# Altium project R1001-Trotta-PF.PrjPcb
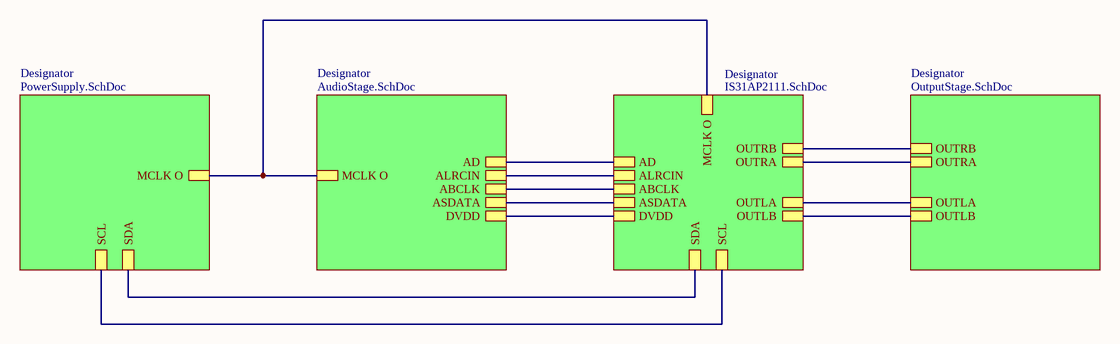
[diagram p0: TopLevel.SchDoc]
5 sheets, 118 parts. Net scope: hierarchical (ports join the sheet entries above them; power ports are global).
Board file: R1001-Trotta-PF-PCB.PcbDoc
Sheets:
  TopLevel.SchDoc
    Designator = PowerSupply.SchDoc
    Designator = AudioStage.SchDoc
    Designator = IS31AP2111.SchDoc
    Designator = OutputStage.SchDoc

## Sheet TopLevel.SchDoc: Top Level
size A4; Organization: Altium Limited; Address1: L3, 12a Rodborough Rd; Address2: Frenchs Forest; Address3: NSW; Address4: Australia 2086; Revision: 1.0; SheetNumber: 1; SheetTotal: 5; Alumno: Trotta, Ignacio; Curso: R1001; Materia: Sistemas de Representación; Docentes: JM Perdomo, E Ipar

### Sub-sheets
Designator = PowerSupply.SchDoc: MCLK O, SDA, SCL
Designator = AudioStage.SchDoc: ASDATA, AD, ALRCIN, ABCLK, MCLK O, DVDD
Designator = IS31AP2111.SchDoc: OUTRB, OUTRA, MCLK O, OUTLA, OUTLB, AD, ALRCIN, ASDATA, DVDD, SDA, SCL, ABCLK
Designator = OutputStage.SchDoc: OUTLB, OUTLA, OUTRB, OUTRA

### Nets
NetC21_1: sheet Designator/OUTLA, sheet Designator/OUTLA
NetC27_2: sheet Designator/OUTLB, sheet Designator/OUTLB
NetC32_1: sheet Designator/OUTRA, sheet Designator/OUTRA
NetC38_2: sheet Designator/OUTRB, sheet Designator/OUTRB
NetC41_1: sheet Designator/DVDD, sheet Designator/DVDD
NetP1_1: sheet Designator/SCL, sheet Designator/SCL
NetP1_2: sheet Designator/SDA, sheet Designator/SDA
NetP3_1: sheet Designator/MCLK O, sheet Designator/MCLK O, sheet Designator/MCLK O
NetP7_2: sheet Designator/AD, sheet Designator/AD
NetR8_1: sheet Designator/ASDATA, sheet Designator/ASDATA
NetR9_1: sheet Designator/ALRCIN, sheet Designator/ALRCIN
NetR10_1: sheet Designator/ABCLK, sheet Designator/ABCLK

### Notes on the sheet
- Title:
- Revision:
- Alumno:
- Materia:
- Docentes:
- Curso:
- File:
- Date:
- Sheet
- of

## Sheet PowerSupply.SchDoc: Power Supply
size A4; Organization: Altium Limited; Address1: L3, 12a Rodborough Rd; Address2: Frenchs Forest; Address3: NSW; Address4: Australia 2086; Revision: 1.0; SheetNumber: 2; SheetTotal: 5; Alumno: Trotta, Ignacio; Curso: R1001; Materia: Sistemas de Representación; Docentes: JM Perdomo, E Ipar
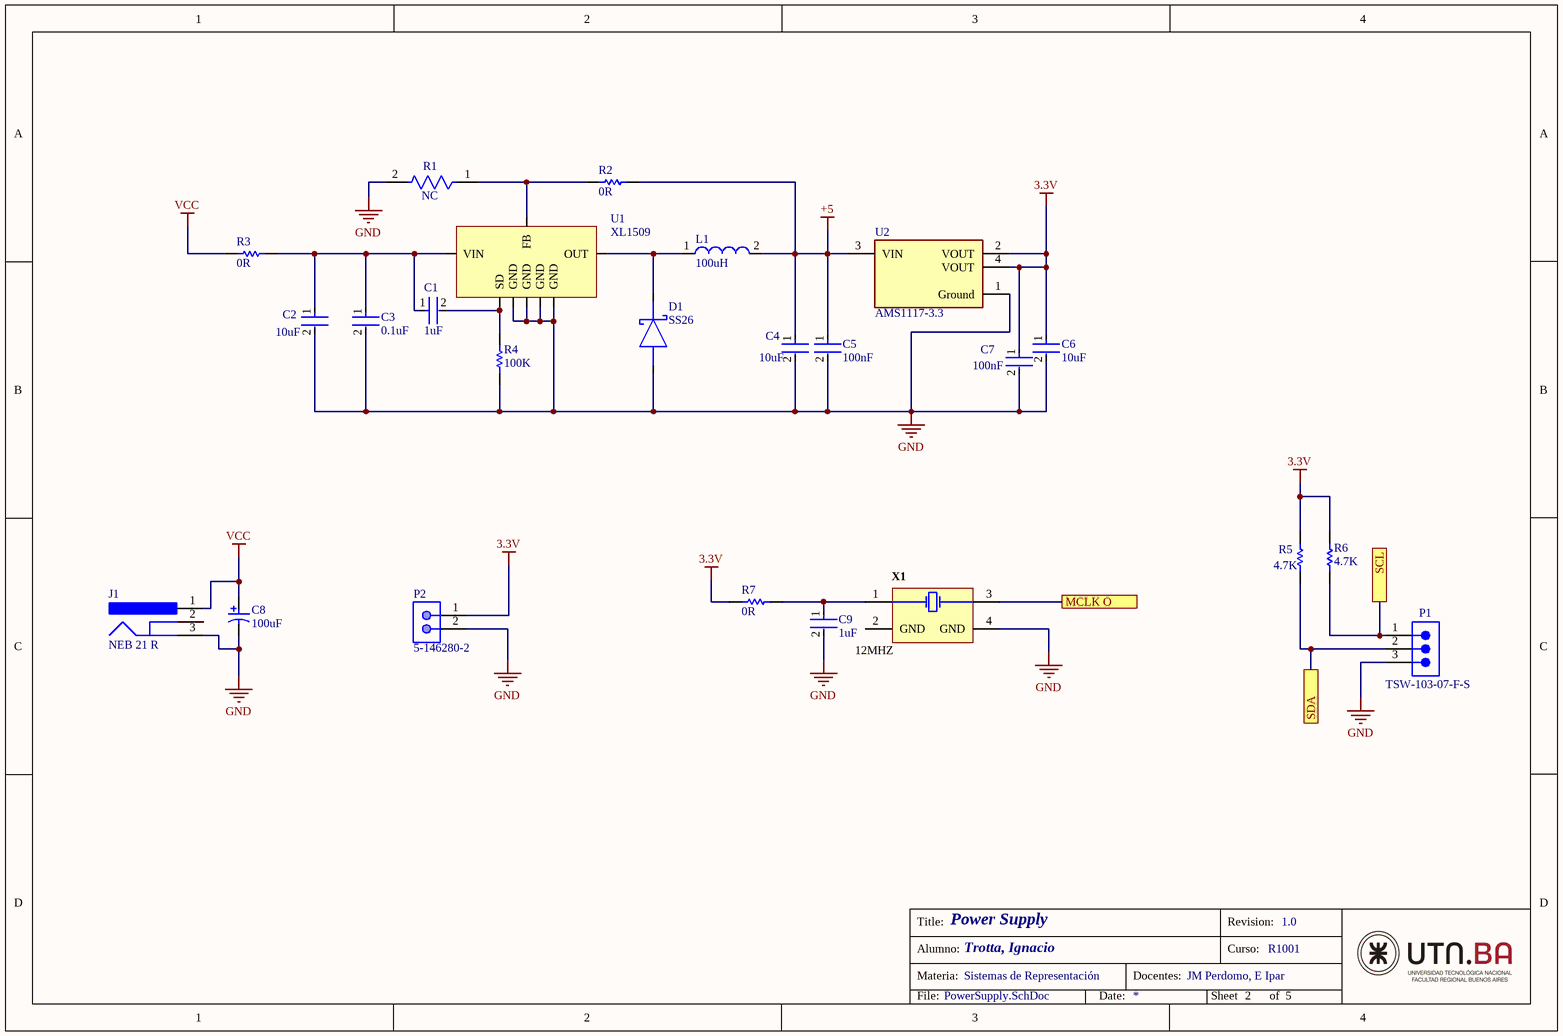
[diagram p1: PowerSupply.SchDoc]

### Parts
C1  1uF  [FP-CC0603-DA-MFG]
C2  10uF  [FP-CC1206-1_25-MFG]
C3  0.1uF  [FP-CC0603-DA-MFG]
C4  10uF  [FP-CC1206-1_25-MFG]
C5  100nF  [FP-CC0603-DA-MFG]
C6  10uF  [FP-CC0805-0_85-MFG]
C7  100nF  [FP-CC0603-DA-MFG]
C8  100uF  [NIC-UCL1V101MNL1GS_L]
C9  1uF  [FP-CC0603-DA-MFG]
D1  SS26  [SMB]
J1  NEB 21 R  [LUMB-NEB21R_V]
L1  100uH  [WE-PD2-M]
P1  TSW-103-07-F-S  [SMTC-TSW-103-07-X-S]
P2  5-146280-2  [TECO-5-146280-2_V]
R1  NC  [FP-RC2012-IPC_A]
R2  0R  [RESC1608X55X25ML10T15]
R3  0R  [RESC1608X55X25ML10T15]
R4  100K  [RESC1608X55X25ML10T15]
R5  4.7K  [RESC1608X55X25ML10T15]
R6  4.7K  [RESC1608X55X25ML10T15]
R7  0R  [RESC1608X55X25ML10T15]
U1  XL1509  [SOIC8]
U2  AMS1117-3.3  [FP-AMS1117-IPC_C]
X1  12MHZ  [ABRACON_ABM8G_V]

### Ports
MCLK O, SCL, SDA

### Nets
3.3V: C6.1 C7.1 P2.1 R5.2 R6.2 R7.1 U2.2(VOUT) U2.4(VOUT)
+5: C4.1 C5.1 L1.2 R2.2 U2.3(VIN)
GND: C2.2 C3.2 C4.2 C5.2 C6.2 C7.2 C8.2 C9.2 D1.A J1.3 P1.3 P2.2 R1.2 R4.1 U1.5(GND) U1.6(GND) U1.7(GND) U1.8(GND) U2.1(Ground) X1.4(GND)
VCC: C8.1 J1.1 R3.1
NetC1_1: C1.1 C2.1 C3.1 R3.2 U1.1(VIN)
NetC1_2: C1.2 R4.2 U1.4(SD)
NetC9_1: C9.1 R7.2 X1.1(X1)
NetD1_C: D1.C(K) L1.1 U1.2(OUT)
NetP1_1: P1.1 R6.1 ; port SCL
NetP1_2: P1.2 R5.1 ; port SDA
NetP3_1: X1.3(X2) ; port MCLK O
NetR1_1: R1.1 R2.1 U1.3(FB)

Not connected (* = marked no-connect by the designer): J1 2; X1 2(GND)

### Notes on the sheet
- Title:
- Revision:
- Alumno:
- Materia:
- Docentes:
- Curso:
- File:
- Date:
- Sheet
- of

### Library data of the parts
C1 C3 C5 C7 C9 = CMP-2100-03600-2: CAP CER 10000PF 50V X7R 0603; Manufacturer Part Number: CC0603KRX7R9BB103; Manufacturer: YAGEO; Tolerance: 0.1; Material: Ceramic; Temperature Coefficient: 15%; Value: 10 nF; Mouser Description: Multilayer Ceramic Capacitor, CC Series, 0.01 - F, - 10%, X7R, 50 V, 0603 [1608 Metric]; Digikey Description: CAP CER 10000PF 50V X7R 0603; Height: 0.9mm; Category: Cap; Temperature Characteristic: X7R; Footprint Url: http://www.yageo.com/exep/pages/download/literatures/UPY-C_GEN_24.pdf; Lead Free: Yes; Voltage Rating: 50 V; Temperature: -55°C to +125°C; Device Class L3: Ceramic Capacitors; ComponentLink2Description: Datasheet; Voltage: 50 V; Package: CC0603-DA; Octopart: https://octopart.com/cc0603krx7r9bb103-yageo-192938; Automotive: No; Temperature Range High: +125°C; Temperature Range Low: -55°C; RoHS: TRUE; Device Class L1: Passive Components; ComponentLink2URL: http://www.yageo.com/documents/recent/UPY-GPHC_X7R_6.3V-to-50V_18.pdf; Device Class L2: Capacitors; Capacitance: 10 nF
C2 C4 = CMP-03422-000842-1: CAP CER 0.1UF 50V X7R 1206; Manufacturer: Yageo; Manufacturer Part Number: CC1206KRX7R9BB104; Automotive Grade: NA; Value: 100 nF; Tolerance: 0.1; Material: Ceramic; Temperature Coefficient: 15%; Temperature Characteristic: X7R; Device Class L1: Passive Components; Lead Free: Yes; Octopart: https://octopart.com/cc1206krx7r9bb104-yageo-39467816; Category: Cap; Temperature Range Low: -55°C; Device Class L3: Ceramic Capacitors; Voltage Rating: 50 V; Temperature Range High: +125°C; Device Class L2: Capacitors; RoHS: TRUE; Package: CC1206-1.25; Footprint Url: http://www.yageo.com/exep/pages/download/literatures/UPY-C_GEN_24.pdf; ComponentLink2Description: Datasheet; Temperature: -55°C to +125°C; Capacitance: 100 nF; Digikey Description: CAP CER 0.1UF 50V X7R 1206; Height: 1.45mm; Automotive: No; Mouser Description: Multilayer Ceramic Capacitors MLCC - SMD/SMT 100nF 50V X7R 10%; ComponentLink2URL: http://www.yageo.com/documents/recent/UPY-NP0X7R_HV_1KV-to-3KV_11.pdf
C6 = CMP-2100-03606-3: CAP CER 0.1UF 50V X7R 0805; Manufacturer Part Number: CC0805KRX7R9BB104; Manufacturer: Yageo; Tolerance: 0.1; Capacitance: 100 nF; Value: 100 nF; Material: Ceramic; Device Class L1: Passive Components; ComponentLink2Description: Datasheet; Package: CC0805-0.85; Digikey Description: CAP CER 0.1UF 50V X7R 0805; Device Class L3: Ceramic Capacitors; Temperature: -30°C to +85°C; Temperature Characteristic: X7R; Voltage Rating: 50 V; Height: 0.95mm; RoHS: TRUE; Ipc Land Pattern Name: CAPC200125X85; Device Class L2: Capacitors; Category: Cap; Temperature Range Low: -30°C; Temperature Range High: +85°C; Mouser Description: Multilayer Ceramic Capacitors MLCC - SMD/SMT 100nF 50V X7R 10%; Footprint Url: http://www.yageo.com/exep/pages/download/literatures/UPY-C_GEN_24.pdf; Automotive: No; Octopart: https://octopart.com/cc0805krx7r9bb104-yageo-192993; Lead Free: Yes; ComponentLink2URL: http://www.yageo.com/documents/recent/UPY-GPHC_Y5V_6.3V-to-50V_8.pdf
C8 = CMP-2000-07344-1: Aluminum Electrolytic Capacitor, 100 uF, 35 V, 20%, -55 to 105 degC, 2-Pin SMD, RoHS, Tape and Reel; Manufacturer: Nichicon; Dissipation Factor DF: 0.12; Case Diameter: 8mm; Ripple Current: 850mA; Type: AluminumElectrolyticCapacitors,ChipType,LowImpedance; Case Height: 8.3mm; Leakage Current: 3uA; Voltage Rating DC: 35V; Load Life: 2000h; Case Length: 10mm; Capacitance: 100uF; Series: CL; Minimum Operating Temperature: -55C; Datasheet URL: http://datasheet.octopart.com/UCL1V101MNL1GS-Nichicon-datasheet-41194108.pdf; Manufacturer URL: http://www.nichicon.co.jp/english/; Maximum Operating Temperature: +105C; Package Reference: UCL1V101MNL1GS; Operating Temperature Range: -55Cto+105C; Brand: Nichicon; Package Description: 2-Pin Surface Mount Device, Body 8.3 x 8.3 mm, Height 10.8 mm; RoHS: Details; Voltage Rating: 35V; Dimensions: 8mmDia.x10mmLx8.3mmH; Termination Style: SMD/SMT; Datasheet Version: 01/2015; Packaging: Reel; Mounting Technology: SurfaceMount; Product Category: AluminumElectrolyticCapacitors-SMD; Factory Pack Quantity: 500; Product: LowImpedanceElectrolyticCapacitors; Tolerance: 20%
D1 = SS26_Trotta: SCHOTTKY BARRIER / RECTIFIER / 2.0 AMPERES / 60 VOLTS
J1 = CMP-2000-06841-1: Jack Socket, Body 14.5 x 9 mm, Height 11 mm, -20 to 70 degC, 3-Pin THD, RoHS, Bulk; Manufacturer: Lumberg; Body Orientation: RightAngle; Voltage Rating: 12Vdc; Current Rating: 3A; Maximum Operating Temperature: +70°C; Mounting Technology: ThroughHole; Termination Method: Solder; Package Description: 3-Pin Through Hole Device, Body 14.5 x 9 mm, Height 11 mm; Datasheet URL: https://datasheet.ciiva.com/11720/0900766b805694d6-11720273.pdf; Datasheet Version: 12/2004; Package Reference: NEB21R; Manufacturer URL: http://www.lumberg.com/; Plug/Socket: Socket; Mounting Type: ThroughHole; Minimum Operating Temperature: -20°C
L1 = CMP-0227-00441-1: SMD Power Inductor WE-PD2, L = 100 µH; Inductance: 100 ÂµH; ComponentLink2Description: Datasheet; ComponentLink1URL: http://www.we-online.com; DatasheetVersion: ver 2, Jun-2005; ComponentLink2URL: http://www.we-online.de/katalog/media/pdf/74477420.pdf; PackageDescription: SMD Inductor, 2-Leads, Body 5.8 x 5.2 mm; PackageVersion: 2005; ComponentLink1Description: Manufacturer Link; PackageReference: WE-PD2-M
P1 = CMP-1024-00331-1: 0.025" SQ Post Header, Through-hole, Vertical, -55 to 125 degC, 2.54 mm Pitch, 3-Pin, Male, RoHS; Manufacturer: Samtec; Pitch: 2.54 mm; DatasheetVersion: F-214; ComponentLink1Description: Manufacturer URL; ComponentLink3URL: http://www.samtec.com/documents/webfiles/cpdf/TSW-XXX-XX-XXX-X-XX-XXX-MKT.pdf; Mounting Technology: Through-hole; PackageDescription: .025[0.64] SQ. Post Terminal Strip Assembly; Temperature Range: -55 to 125 degC; ComponentLink3Description: Package Specification; Orientation: Vertical; PartNumber: TSW-103-07-F-S; RoHS: True; PackageVersion: DM, 8/1988; ComponentLink2Description: Datasheet; ComponentLink1URL: http://www.samtec.com; ComponentLink2URL: http://www.samtec.com/documents/webfiles/pdf/TSW_TH.PDF; PackageReference: TSW-103-07-X-S
P2 = CMP-2000-07492-1: Male Header, Pitch 2.54 mm, 1 x 2 Position, Height 8.21 mm, Tail Length 3.05 mm, -65 to 105 degC, RoHS, Bulk; Manufacturer: TE Connectivity; Mating Connector Lock: No(Without); Number of Positions: 2; Pitch: 2.54mm; PCB Mounting Orientation: Vertical; Keyed: No; Case\/Package: 100; Mating Post Length: 0.23inch; High Temperature Housing: Yes; Max Current Rating: 5A; PCB Thickness: 0.063inch; PCB Mount Retention: Without; Approvals: CSA; Current Rating: 3A; Radiation Hardening: No; Length: 4.67mm; Contact Mating Length: 0.23inch; Connector Type: Header; Number of Rows: 1; Termination Post Length: 0.12inch; Board Standoff: No(Without); Max Operating Temperature: 105degC; Contact Shape: Square; Selectively Loaded: No(Without); Gasket: No(Without); Number of Contacts: 2; Contact Gender: Male; Mating Alignment: No(Without); Manufacturer URL: http://www.te.com/; Datasheet URL: http://www.te.com/commerce/DocumentDelivery/DDEController?Action=showdoc&DocId=Customer+Drawing%7F146280%7FH1%7Fpdf%7FEnglish%7FENG_CD_146280_H1.pdf%7F5-146280-2; Mount: ThroughHole; Orientation: Straight; Packaging: Carton; Package Reference: 5-146280-2; Package Quantity: 500; Stabilizers: No(Without); Row Spacing: 2.54mm; Contact Material: CopperAlloy; Panel Mount Retention: No(Without); Datasheet Version: Rev. H1, 08/2016; Housing Colour: Black; Colour: Black; Package Description: Male Header, Pitch 2.54 mm, 1 x 2 Position, Height 8.21 mm, Tail Length 3.05 mm; Contact Plating: Matte; Housing Material: Polymer; Contact Protection: No(Without); Min Operating Temperature: -65degC; Mounting Technology: ThroughHole; Flammability Rating: UL94V-0; RoHSCompliant: true; Termination: ThroughHole; Depth: 2.34mm; High Speed Serial Data Connector: No
R1 = CMP-13261-003410-1: Res Thick Film 0805 11.5kΩ 1% 0.125W ±100ppm/°C Molded SMD T/R; Power Rating: 125mW; Voltage Rating (DC): 150V; Resistance: 11.5kR; Case Code (Metric): 2012; Composition: Thick Film; Width: 0.049inch; Case Code (Imperial): 0805; Package Quantity: 1; Case/Package: 0805; Features: Moisture Resistant; Number of Terminations: 2; Height: 0.024inch; Max Operating Temperature: 155°C; Max Power Dissipation: 125mW; Min Operating Temperature: -55°C; Temperature Coefficient: 100ppm/°C; Tolerance: 1%; Length: 0.079inch; Lead Free: Lead Free; Packaging: Tape and Reel
R2-R4 R7 = CMP-2000-05021-1: Chip Resistor, 100 Ohm, +/- 5%, 50 V, 0603 (1608 Metric), RoHS, Tape and Reel; Manufacturer: Yageo; Temperature Coefficient: 100PPM/C; Resistance: 100Ohms; Power Rating: 100mW; Voltage Rating: 50V; Manufacturer URL: http://www.yageo.com/; Product: ThickFilmResistorsGeneralPurpose; Package Description: 2-Pin Surface Mount Device, Body 1.6 x 0.8 mm; Tolerance: 5%; Termination Style: SMD/SMT; Datasheet URL: http://www.farnell.com/datasheets/443971.pdf; Operating Temperature Range: -55Cto+155C; Packaging: Reel; Case Code - in: 0603; Package Reference: 603; Series: RC; Case Code - mm: 1608; Datasheet Version: Rev. 4, 04/2009
R5 R6 = CMP-2000-05024-1: Chip Resistor, 4.7 KOhm, +/- 5%, 100 mW, -55 to 155 degC, 0603 (1608 Metric), RoHS, Tape and Reel; Manufacturer: Yageo; Resistance: 4.7kOhms; Temperature Coefficient: 100PPM/C; Power Rating: 100mW; Voltage Rating: 50V; Operating Temperature Range: -55Cto+155C; Case Code - mm: 1608; Tolerance: 5%; Product: ThickFilmResistorsGeneralPurpose; Case Code - in: 0603; Datasheet URL: http://www.yageo.com/documents/recent/PYu-RC_Group_51_RoHS_L_04.pdf; Package Reference: 603; Datasheet Version: Rev. 4, 02/2016; Package Description: 2-Pin Surface Mount Device, Body 1.6 x 0.8 mm; Manufacturer URL: http://www.yageo.com/; Series: RC; Packaging: Reel; Termination Style: SMD/SMT
U1 = XL1509_Trotta: 2A 150KHz 40V Buck DC to DC Converter
U2 = CMP-209535-000001-1: LDO Voltage Regulators 1A, 3.3V; Manufacturer: Advanced Monolithic Systems; Dropout Voltage: 1.1V; Output Type: Fixed; Nominal Supply Current: 5mA; Max Power Dissipation: 1.2W; Max Supply Voltage: 15V; Number Of Outputs: 1; Standoff Height: 0.64mm; Max Junction Temp: +125°C; Height: 1.8mm; Package: AMS1117; Device Class L2: Power Management ICs; ComponentLink2Description: Datasheet; ComponentLink2URL: http://www.advanced-monolithic.com/pdf/ds1117.pdf; Category: IC; RoHS: TRUE; Automotive: No; Device Class L1: Integrated Circuits (ICs); Output Current: 1A; Device Class L3: Voltage Regulators - Linear; Temperature: -40°C to +125°C; Output Voltage: 3.3V; Manufacturer Part Number: AMS1117-3.3; Temperature Range Low: -40°C; Octopart: https://octopart.com/ams1117-3.3-advanced+monolithic+systems-25899300; Lead Free: Yes; Ipc Land Pattern Name: SOT229P700X180-4; Temperature Range High: +125°C
X1 = CMP-2000-05039-1: Ultra Miniature Ceramic Glass Sealed SMD Cryastal, 12 MHz, 18 pF, +/- 20 ppm, -40 to 85 degC, 4-Pin SMD, RoHS, Tape and Reel; Brand: ABRACON; ESR: 120Ohms; Case Length: 3.2mm; Tolerance: 20PPM; Frequency Stability: 30PPM; Case Height: 1mm; Case Width: 2.5mm; Load Capacitance: 18pF; Termination Style: SMD/SMT; Mounting Style: SMD/SMT; Factory Pack Quantity: 1000; Series: ABM8G; Datasheet Version: Apr-17; Manufacturer: ABRACON; Packaging: Reel; Manufacturer URL: http://www.abracon.com/; RoHS: Details; Package / Case: 3.2mmx2.5mm; Type: UltraMiniatureGlassSealedCrystal; Datasheet URL: https://datasheet.ciiva.com/15116/getdatasheetpartid-719790-15116701.pdf; Operating Temperature Range: -40Cto+85C; Frequency: 12MHz; Product Category: Crystals; Dimensions: 2.5mmWx3.2mmLx1mmH

## Sheet AudioStage.SchDoc: Audio stage
size A4; Revision: 1.0; SheetNumber: 5; SheetTotal: 5; Alumno: Trotta, Ignacio; Curso: R1001; Materia: Sistemas de Representación; Docentes: JM Perdomo, E Ipar
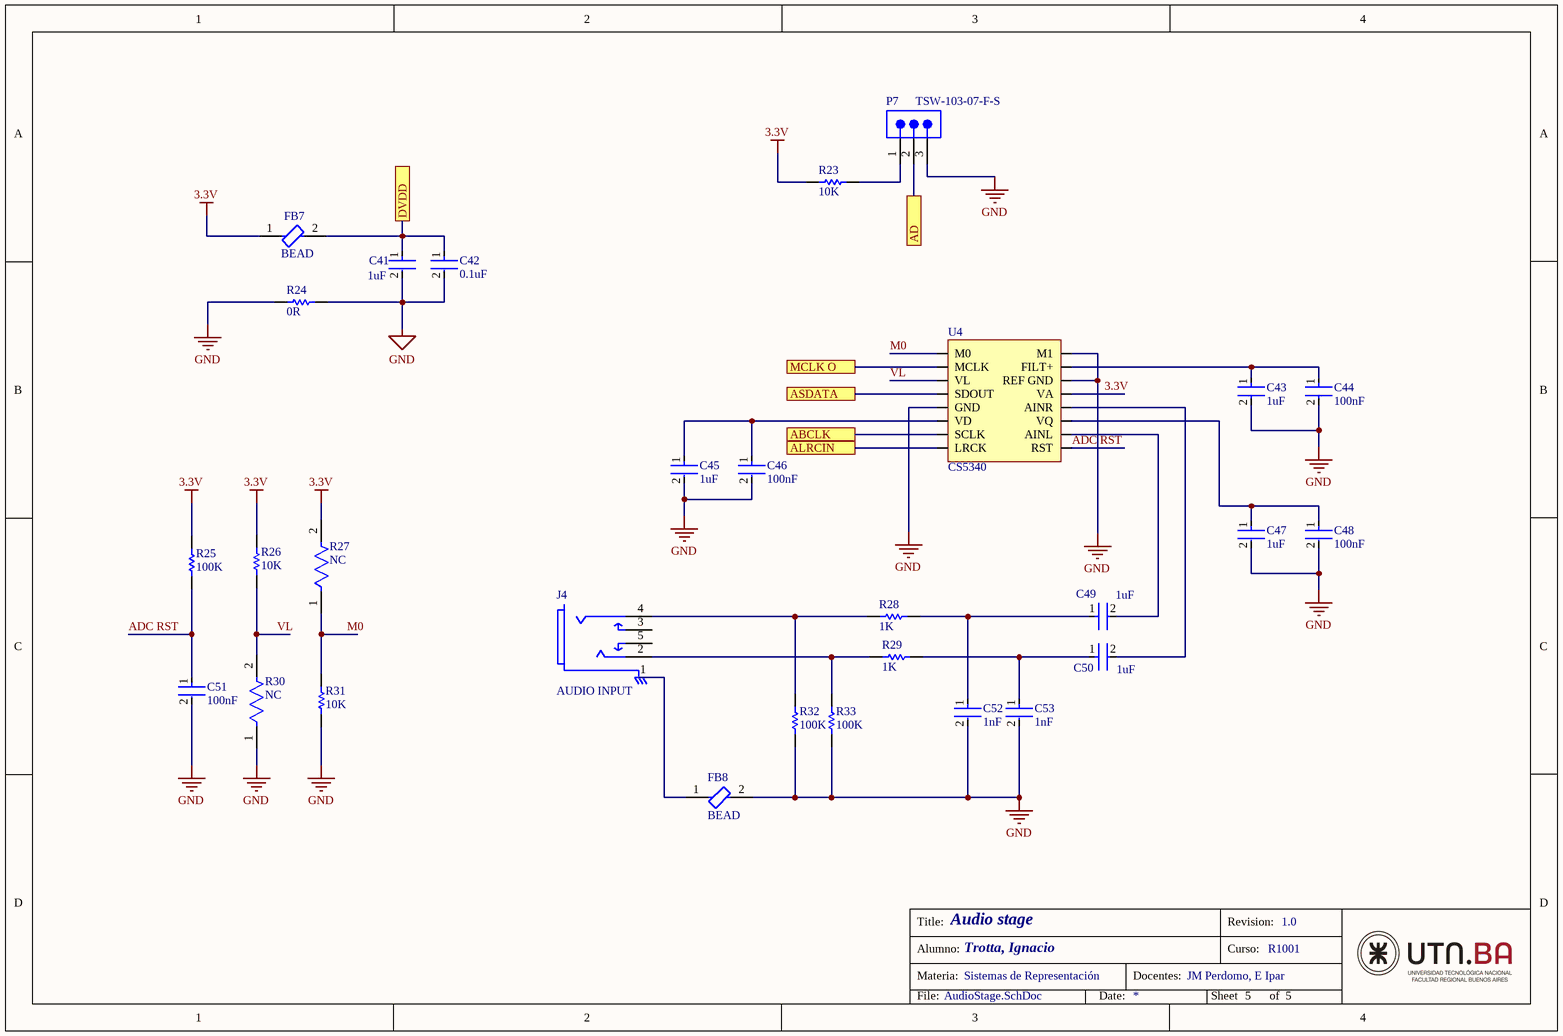
[diagram p2: AudioStage.SchDoc]

### Parts
C41  1uF  [FP-CC0603-DA-MFG]
C42  0.1uF  [FP-CC0603-DA-MFG]
C43  1uF  [FP-CC0603-DA-MFG]
C44  100nF  [FP-CC0603-DA-MFG]
C45  1uF  [FP-CC0603-DA-MFG]
C46  100nF  [FP-CC0603-DA-MFG]
C47  1uF  [FP-CC0603-DA-MFG]
C48  100nF  [FP-CC0603-DA-MFG]
C49  1uF  [FP-CC0603-DA-MFG]
C50  1uF  [FP-CC0603-DA-MFG]
C51  100nF  [FP-CC0603-DA-MFG]
C52  1nF  [FP-CC0603-DA-MFG]
C53  1nF  [FP-CC0603-DA-MFG]
FB7  BEAD  [FP-BLM18-0_15-t0_8-IPC_B]
FB8  BEAD  [FP-BLM18-0_15-t0_8-IPC_B]
J4  AUDIO INPUT  [FP-35RAPC4BV4-MFG]
P7  TSW-103-07-F-S  [SMTC-TSW-103-07-X-S]
R23  10K  [RESC1608X55X25ML10T15]
R24  0R  [RESC1608X55X25ML10T15]
R25  100K  [RESC1608X55X25ML10T15]
R26  10K  [RESC1608X55X25ML10T15]
R27  NC  [FP-CR0805-MFG]
R28  1K  [RESC1608X55X25ML10T15]
R29  1K  [RESC1608X55X25ML10T15]
R30  NC  [FP-CR0805-MFG]
R31  10K  [RESC1608X55X25ML10T15]
R32  100K  [RESC1608X55X25ML10T15]
R33  100K  [RESC1608X55X25ML10T15]
U4  CS5340  [TSSOP-16L]

### Ports
ABCLK, AD, ALRCIN, ASDATA, DVDD, MCLK O

### Nets
3.3V: FB7.1 R23.1 R25.2 R26.2 R27.2 U4.13(VA)
GND: C41.2 C42.2 C43.2 C44.2 C45.2 C46.2 C47.2 C48.2 C51.2 C52.2 C53.2 FB8.2 P7.3 R24.1 R24.2 R30.1 R31.1 R32.1 R33.1 U4.5(GND) U4.14(REF_GND) U4.16(M1)
ADC RST: C51.1 R25.1 U4.9(RST)
M0: R27.1 R31.2 U4.1(M0)
VL: R26.1 R30.2 U4.3(VL)
NetC41_1: C41.1 C42.1 FB7.2 ; port DVDD
NetC43_1: C43.1 C44.1 U4.15(FILT+)
NetC45_1: C45.1 C46.1 U4.6(VD)
NetC47_1: C47.1 C48.1 U4.11(VQ)
NetC49_1: C49.1 C52.1 R28.2
NetC49_2: C49.2 U4.10(AINL)
NetC50_1: C50.1 C53.1 R29.2
NetC50_2: C50.2 U4.12(AINR)
NetFB8_1: FB8.1 J4.1
NetJ4_2: J4.2 R29.1 R33.2
NetJ4_4: J4.4 R28.1 R32.2
NetP3_1: U4.2(MCLK) ; port MCLK O
NetP7_1: P7.1 R23.2
NetP7_2: P7.2 ; port AD
NetR8_1: U4.4(SDOUT) ; port ASDATA
NetR9_1: U4.8(LRCK) ; port ALRCIN
NetR10_1: U4.7(SCLK) ; port ABCLK

Not connected (* = marked no-connect by the designer): J4 3 5

### Notes on the sheet
- Title:
- Revision:
- Alumno:
- Materia:
- Docentes:
- Curso:
- File:
- Date:
- Sheet
- of

### Library data of the parts
C41-C53 = CMP-2100-03600-2: as C1 on sheet PowerSupply; Mouser Description: Multilayer Ceramic Capacitor, CC Series, 0.01 - F, - 10%, X7R, 50 V, 0603 [1608 Metric]; Digikey Description: CAP CER 10000PF 50V X7R 0603; Height: 0.9mm; Category: Cap; Temperature Characteristic: X7R; Footprint Url: http://www.yageo.com/exep/pages/download/literatures/UPY-C_GEN_24.pdf; Lead Free: Yes; Voltage Rating: 50 V; Temperature: -55°C to +125°C; Device Class L3: Ceramic Capacitors; ComponentLink2Description: Datasheet; Voltage: 50 V; Package: CC0603-DA; Octopart: https://octopart.com/cc0603krx7r9bb103-yageo-192938; Automotive: No; Temperature Range High: +125°C; Temperature Range Low: -55°C; RoHS: TRUE; Device Class L1: Passive Components; ComponentLink2URL: http://www.yageo.com/documents/recent/UPY-GPHC_X7R_6.3V-to-50V_18.pdf; Device Class L2: Capacitors; Capacitance: 10 nF
FB7 FB8 = CMP-0686-00503-3: Chip Ferrite Bead, 0603, 75Ω @ 100MHz, 0.3Ω, 25%, 600mA; Resistance: 350mR; Max DC Current: 500mA; Shielding: Unshielded; Number of Lines: 1; Impedance: 75R; Conductor Material: Copper; Material: Steel; DC Resistance (DCR): 300mR; Temperature Coefficient: 10ppm/°C; Max Current Rating: 500mA; Case/Package: 0603; Case Code (Imperial): 0603; DC Current: 500mA; Test Frequency: 100MHz; Military Standard: Not; Series: BLM18B; Min Operating Temperature: -55°C; Number of Pins: 2; Termination: SMD/SMT; Length: 1.6mm; Packaging: Tape and Reel; Max Operating Temperature: 125°C; Package Quantity: 1; REACH SVHC: No SVHC; Height: 0.8mm; Radiation Hardening: No; Depth: 0.8mm; Tolerance: 25%; Current Rating: 500mA; Width: 0.8mm; Core Material: Ferrite; RoHS Compliant: Yes; DC Resistance-Max: 300mR; Lead Free: Lead Free; Case Code (Metric): 1608; Number of Circuits: 1
J4 = CMP-47983-000001-1: CONN JACK STEREO 3.5MM R/A; Manufacturer: Switchcraft; Obsolete Part: true; Manufacturer Part Number: 35RAPC4BV4; Conn Orientation: Right Angle; Number Of Contacts: 5; Contact Material: Silver; Device Class L1: Connectors; Height: 0.495inch; ComponentLink2URL: http://www.switchcraft.com/Drawings/35rapc__v4_cd.pdf; Category: Conn; Digikey Description: CONN JACK STEREO 3.5MM R/A; Automotive: No; ComponentLink2Description: Datasheet; Package: 35RAPC4BV4; Device Class L2: Audio / Video Connectors; Mouser Description: Phone Connectors 3.5MM VERT STEREO JK; RoHS: TRUE; Octopart: https://octopart.com/35rapc4bv4-switchcraft-223606; Lead Free: Yes; Device Class L3: unset
P7 = CMP-1024-00331-1: as P1 on sheet PowerSupply; DatasheetVersion: F-214; ComponentLink1Description: Manufacturer URL; ComponentLink3URL: http://www.samtec.com/documents/webfiles/cpdf/TSW-XXX-XX-XXX-X-XX-XXX-MKT.pdf; Mounting Technology: Through-hole; PackageDescription: .025[0.64] SQ. Post Terminal Strip Assembly; Temperature Range: -55 to 125 degC; ComponentLink3Description: Package Specification; Orientation: Vertical; PartNumber: TSW-103-07-F-S; RoHS: True; PackageVersion: DM, 8/1988; ComponentLink2Description: Datasheet; ComponentLink1URL: http://www.samtec.com; ComponentLink2URL: http://www.samtec.com/documents/webfiles/pdf/TSW_TH.PDF; PackageReference: TSW-103-07-X-S
R23-R26 R31-R33 = CMP-2000-05021-1: as R2 on sheet PowerSupply; Manufacturer URL: http://www.yageo.com/; Product: ThickFilmResistorsGeneralPurpose; Package Description: 2-Pin Surface Mount Device, Body 1.6 x 0.8 mm; Tolerance: 5%; Termination Style: SMD/SMT; Datasheet URL: http://www.farnell.com/datasheets/443971.pdf; Operating Temperature Range: -55Cto+155C; Packaging: Reel; Case Code - in: 0603; Package Reference: 603; Series: RC; Case Code - mm: 1608; Datasheet Version: Rev. 4, 04/2009
R27 R30 = CMP-07231-001707-1: Thick Film Chip Resistors 0805 100kΩ 0.125W 5% 200ppm/°C; Power Rating: 125mW; Voltage Rating: 150V; Resistance: 100kR; Case Code (Metric): 2012; Case Code (Imperial): 0805; Temperature Coefficient: 200ppm/°C; Mount: Surface Mount; Tolerance: 5%; Radiation Hardening: No; Military Standard: Not; Contact Plating: Tin; Number of Terminations: 2; Packaging: Tape and Reel; Thickness: 508um; Length: 0.079inch; Depth: 1.25mm; Min Operating Temperature: -55°C; Features: Moisture Resistant; Max Operating Temperature: 155°C; Width: 0.049inch; Package Quantity: 10000; Termination: SMD/SMT; Composition: Thick Film; Max Power Dissipation: 125mW; Height: 0.024inch; Case/Package: 0805
R28 R29 = CMP-2100-03667-1: Chip Resistor, 0 Ohm, +/- 5%, 0.1 W, -55 to 155 degC, 0603 (1608 Metric), RoHS, Tape and Reel; Manufacturer: Yageo; Temperature Coefficient: 200ppm/degreesC; Voltage Rating: 50V; Power Rating: 100mW; Resistance: 0mOhm; Width: 0.8mm; Max Operating Temperature: 155degC; Tolerance: 5%; Package Reference: 0603; Height: 0.45mm; Depth: 0.8mm; Package Description: 2-Pin Surface Mount Device, Body 1.6 x 0.8 mm; Termination: SMD/SMT; Package Quantity: 5000; Case/Package: 0603; Case Code (Imperial): 0603; Radiation Hardening: No; Number of Pins: 2; Length: 1.6mm; Lead Free: LeadFree; Voltage Rating (DC): 50V; Military Standard: Not; Datasheet URL: http://www.yageo.com/NewPortal/yageodocoutput?fileName=/pdf/R-Chip/PYu-RC_Group_51_RoHS_L_5.pdf; Manufacturer URL: http://www.yageo.com/; Packaging: TapeandReel; Case Code (Metric): 1608; Min Operating Temperature: -55degC; Composition: ThickFilm; RoHSCompliant: true; Contact Plating: Tin; Datasheet Version: Rev. 5, 10/2016; REACH SVHC: NoSVHC
U4 = CS5340_Trotta: 101dB, 192kHz, Multi-Bit Audio A/D Converter

## Sheet IS31AP2111.SchDoc: IS31AP2111
size A4; Organization: Altium Limited; Address1: L3, 12a Rodborough Rd; Address2: Frenchs Forest; Address3: NSW; Address4: Australia 2086; Revision: 1.0; SheetNumber: 3; SheetTotal: 5; Alumno: Trotta, Igancio; Curso: R1001; Materia: Sistemas de Representación; Docentes: JM Perdomo, E Ipar
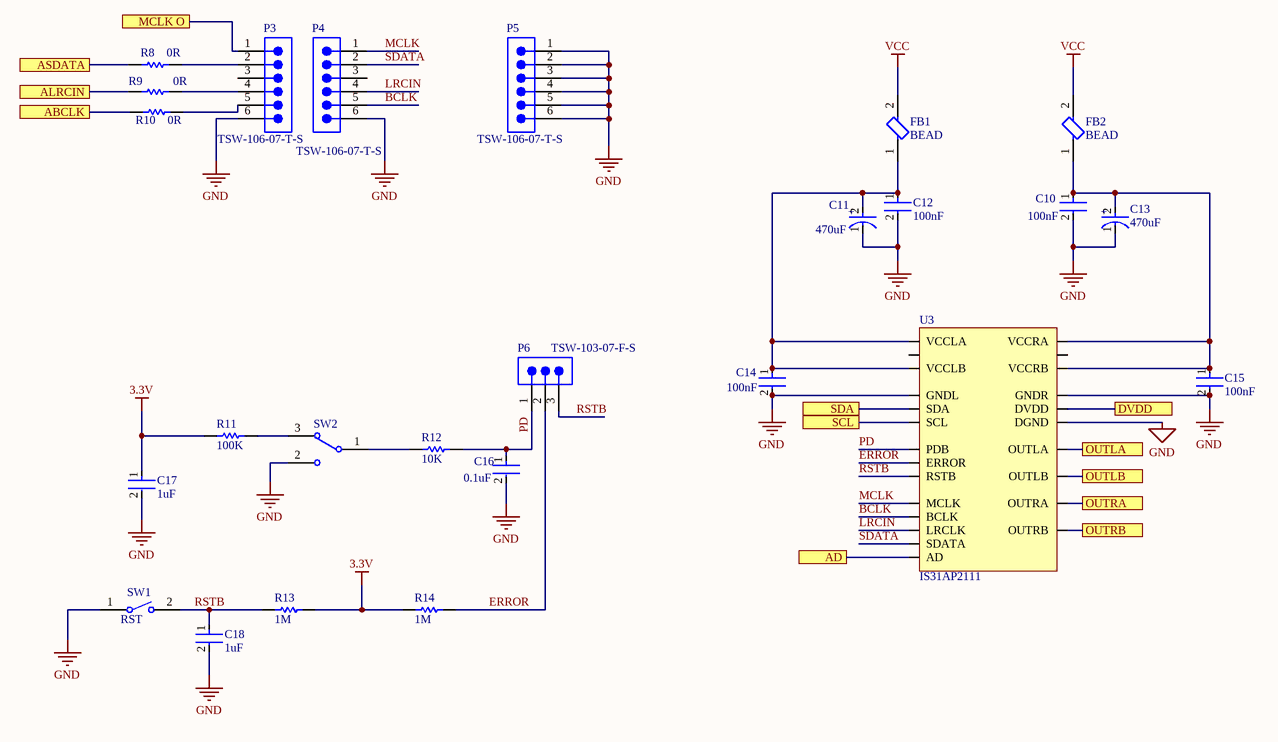
[diagram p3: IS31AP2111.SchDoc]

### Parts
C10  100nF  [FP-CC0603-DA-MFG]
C11  470uF  [FP-UUX0J471MNL1GS-MFG]
C12  100nF  [FP-CC0603-DA-MFG]
C13  470uF  [FP-UUX0J471MNL1GS-MFG]
C14  100nF  [FP-CC0603-DA-MFG]
C15  100nF  [FP-CC0603-DA-MFG]
C16  0.1uF  [FP-CC0603-DA-MFG]
C17  1uF  [FP-CC0603-DA-MFG]
C18  1uF  [FP-CC0603-DA-MFG]
FB1  BEAD  [FP-BLM18-0_15-t0_8-IPC_A]
FB2  BEAD  [FP-BLM18-0_15-t0_8-IPC_A]
P3  TSW-106-07-T-S  [SMTC-TSW-106-07-X-S]
P4  TSW-106-07-T-S  [SMTC-TSW-106-07-X-S]
P5  TSW-106-07-T-S  [SMTC-TSW-106-07-X-S]
P6  TSW-103-07-F-S  [SMTC-TSW-103-07-X-S]
R8  0R  [RESC1608X55X25ML10T15]
R9  0R  [RESC1608X55X25ML10T15]
R10  0R  [RESC1608X55X25ML10T15]
R11  100K  [RESC1608X55X25ML10T15]
R12  10K  [RESC1608X55X25ML10T15]
R13  1M  [RESC1608X55X25LL10T15]
R14  1M  [RESC1608X55X25LL10T15]
SW1  RST  [TECO-FSMSM-2_V]
SW2  450301014042  [450301014042]  (value not drawn)
U3  IS31AP2111  [eTSSOP-24]

### Ports
ABCLK, AD, ALRCIN, ASDATA, DVDD, MCLK O, OUTLA, OUTLB, OUTRA, OUTRB, SCL, SDA

### Nets
3.3V: C17.1 R11.1 R13.2 R14.1
GND: C10.2 C11.1(C) C12.2 C13.1(C) C14.2 C15.2 C16.2 C17.2 C18.2 P3.6 P4.6 P5.1 P5.2 P5.3 P5.4 P5.5 P5.6 SW1.1 SW2.2 U3.8(DGND) U3.16(GNDR) U3.21(GNDL)
VCC: FB1.2 FB2.2
BCLK: P4.5 U3.12(BCLK)
ERROR: P6.2 R14.2 U3.2(ERROR)
LRCIN: P4.4 U3.4(LRCLK)
MCLK: P4.1 U3.11(MCLK)
PD: C16.1 P6.1 R12.2 U3.1(PDB)
RSTB: C18.1 P6.3 R13.1 SW1.2 U3.7(RSTB)
SDATA: P4.2 U3.3(SDATA)
NetC10_1: C10.1 C13.2(A) C15.1 FB2.1 U3.13(VCCRA) U3.18(VCCRB)
NetC11_2: C11.2(A) C12.1 C14.1 FB1.1 U3.19(VCCLB) U3.24(VCCLA)
NetC21_1: U3.22(OUTLA) ; port OUTLA
NetC27_2: U3.20(OUTLB) ; port OUTLB
NetC32_1: U3.15(OUTRA) ; port OUTRA
NetC38_2: U3.17(OUTRB) ; port OUTRB
NetC41_1: U3.9(DVDD) ; port DVDD
NetP1_1: U3.6(SCL) ; port SCL
NetP1_2: U3.5(SDA) ; port SDA
NetP3_1: P3.1 ; port MCLK O
NetP3_2: P3.2 R8.2
NetP3_4: P3.4 R9.2
NetP3_5: P3.5 R10.2
NetP7_2: U3.10(AD) ; port AD
NetR8_1: R8.1 ; port ASDATA
NetR9_1: R9.1 ; port ALRCIN
NetR10_1: R10.1 ; port ABCLK
NetR11_2: R11.2 SW2.3
NetR12_1: R12.1 SW2.1

Not connected (* = marked no-connect by the designer): P3 3; P4 3; U3 14 23

### Notes on the sheet
- Title:
- Revision:
- Alumno:
- Materia:
- Docentes:
- Curso:
- File:
- Date:
- Sheet
- of
- (in symbol CMP-12462-000017-1) +

### Library data of the parts
C10 C12 C14-C18 = CMP-2100-03600-2: CAP CER 10000PF 50V X7R 0603; Manufacturer Part Number: CC0603KRX7R9BB103; Manufacturer: YAGEO; Tolerance: 0.1; Material: Ceramic; Temperature Coefficient: 15%; Description: CC0603 10 nF X7R 10.00% 50 V; Value: 10 nF; Mouser Description: Multilayer Ceramic Capacitor, CC Series, 0.01 - F, - 10%, X7R, 50 V, 0603 [1608 Metric]; Digikey Description: CAP CER 10000PF 50V X7R 0603; Height: 0.9mm; Category: Cap; Temperature Characteristic: X7R; Footprint Url: http://www.yageo.com/exep/pages/download/literatures/UPY-C_GEN_24.pdf; Lead Free: Yes; Voltage Rating: 50 V; Temperature: -55°C to +125°C; Device Class L3: Ceramic Capacitors; ComponentLink2Description: Datasheet; Voltage: 50 V; Package: CC0603-DA; Octopart: https://octopart.com/cc0603krx7r9bb103-yageo-192938; Automotive: No; Temperature Range High: +125°C; Temperature Range Low: -55°C; RoHS: TRUE; Device Class L1: Passive Components; ComponentLink2URL: http://www.yageo.com/documents/recent/UPY-GPHC_X7R_6.3V-to-50V_18.pdf; Device Class L2: Capacitors; Capacitance: 10 nF
C11 C13 = CMP-12462-000017-1: CAP ALUM 470UF 20% 6.3V SMD; Leakage Current: 88.83uA; Life (Hours): 2000Hour; Ripple Current: 340mA; Termination: SMD/SMT; Case/Package: Radial; Package Quantity: 1; Height: 10mm; Min Operating Temperature: -55°C; Radiation Hardening: No; Tolerance: 20%; Length: 10mm; Capacitance: 470uF; Height - Seated (Max): 0.394inch; Features: General Purpose; Voltage Rating (DC): 6.3V; Max Operating Temperature: 105°C; Mount: Surface Mount; Packaging: Tape and Reel; Voltage Rating: 6.3V; Diameter: 10mm
FB1 FB2 = CMP-0686-00557-7: Chip Ferrite Bead, 0603, 120Ω @ 100MHz, 0.05Ω, 25%, 2A; Impedance: 120R; Number of Circuits: 1; Shielding: Unshielded; Material: Steel; DC Resistance (DCR): 50mR; Case Code (Imperial): 0603; RoHS Compliant: Yes; Number of Pins: 2; Min Operating Temperature: -55°C; Case Code (Metric): 1608; Frequency: 100MHz; Length: 1.6mm; Test Frequency: 100MHz; Max Operating Temperature: 125°C; Packaging: Tape and Reel; Max Current Rating: 2A; Termination: SMD/SMT; Lead Free: Lead Free; Max DC Current: 2A; Case/Package: 0603; Height: 0.8mm; Current Rating: 2A; Radiation Hardening: No; Core Material: Ferrite; DC Current: 2A; REACH SVHC: No SVHC; Package Quantity: 1; Depth: 0.8mm; Number of Lines: 1; Tolerance: 25%; Width: 0.8mm
P3-P5 = CMP-1024-00384-1: 0.025" SQ Post Header, Through-hole, Vertical, -55 to 105 degC, 2.54 mm Pitch, 6-Pin, Male, RoHS; Manufacturer: Samtec; Pitch: 2.54 mm; ComponentLink3URL: http://www.samtec.com/documents/webfiles/cpdf/TSW-XXX-XX-XXX-X-XX-XXX-MKT.pdf; ComponentLink1Description: Manufacturer URL; Orientation: Vertical; ComponentLink2Description: Datasheet; ComponentLink1URL: http://www.samtec.com; RoHS: True; DatasheetVersion: F-214; PackageDescription: .025[0.64] SQ. Post Terminal Strip Assembly; PartNumber: TSW-106-07-T-S; Mounting Technology: Through-hole; PackageReference: TSW-106-07-X-S; PackageVersion: DM, 8/1988; ComponentLink3Description: Package Specification; ComponentLink2URL: http://www.samtec.com/documents/webfiles/pdf/TSW_TH.PDF; Temperature Range: -55 to 105 degC
P6 = CMP-1024-00331-1: as P1 on sheet PowerSupply; DatasheetVersion: F-214; ComponentLink1Description: Manufacturer URL; ComponentLink3URL: http://www.samtec.com/documents/webfiles/cpdf/TSW-XXX-XX-XXX-X-XX-XXX-MKT.pdf; Mounting Technology: Through-hole; PackageDescription: .025[0.64] SQ. Post Terminal Strip Assembly; Temperature Range: -55 to 125 degC; ComponentLink3Description: Package Specification; Orientation: Vertical; PartNumber: TSW-103-07-F-S; RoHS: True; PackageVersion: DM, 8/1988; ComponentLink2Description: Datasheet; ComponentLink1URL: http://www.samtec.com; ComponentLink2URL: http://www.samtec.com/documents/webfiles/pdf/TSW_TH.PDF; PackageReference: TSW-103-07-X-S
R8-R12 = CMP-2000-05021-1: as R2 on sheet PowerSupply; Manufacturer URL: http://www.yageo.com/; Product: ThickFilmResistorsGeneralPurpose; Package Description: 2-Pin Surface Mount Device, Body 1.6 x 0.8 mm; Tolerance: 5%; Termination Style: SMD/SMT; Datasheet URL: http://www.farnell.com/datasheets/443971.pdf; Operating Temperature Range: -55Cto+155C; Packaging: Reel; Case Code - in: 0603; Package Reference: 603; Series: RC; Case Code - mm: 1608; Datasheet Version: Rev. 4, 04/2009
R13 R14 = CMP-2000-06953-1: General Purpose Chip Resistor, 1 MOhm, +/- 5%, -55 to 155 degC, 0603 (1608 Metric), RoHS, Tape and Reel; Manufacturer: Yageo; Power Rating: 100mW; Product Range: RCSeries; Temperature Coefficient: ±100ppm/°C; Resistor Element Type: ThickFilm; Resistance: 1Mohm; SVHC: ToBeAdvised; Voltage Rating: 50V; Resistor Case Style: 0603[1608Metric]; MSL: MSL1-Unlimited; Package Description: 2-Pin Surface Mount Device, Body 1.6 x 0.8 mm; Resistance Tolerance: ±5%; Datasheet Version: Rev. 7, 05/2017; Datasheet URL: http://www.yageo.com/documents/recent/PYu-RC_Group_51_RoHS_L_7.pdf; Manufacturer URL: http://www.yageo.com/; Package Reference: 0603; Automotive Qualification Standard: -; Packaging: CutTape; Mounting Technology: SurfaceMount
SW1 = CMP-2000-07511-1: FSMSM Push Button Switch, 50 mA, -35 to 85 degC, 2-Pin SMD, RoHS, Bulk; Manufacturer: TE Connectivity; Actuator Length: 1.07mm; Electrical Life: 20000Cycles; Actuator Material: Polyamide; Current Rating: 50mA; Illumination Type: Illuminated; Voltage Rating (DC): 24V; Contact Resistance: 100mOhm; Case\/Package: SMD/SMT; Operating Force: 180gf; Switch Travel: 0.25mm; Max Voltage Rating (DC): 12V; Throw Configuration: SPST; Packaging: LoosePiece; Max Operating Temperature: 85degC; ELV: Compliant; Package Description: 2-Pin Surface Mount Device, Body 6 x 3.5 mm, Pitch 9.19 mm; RoHSCompliant: true; Manufacturer URL: http://www.te.com/; Contact Plating: Silver; Contact Material: Brass; Mounting Technology: SurfaceMount; Contact Current Rating: 50mA; Datasheet Version: Rev. C2, 08/2014; Datasheet URL: http://www.te.com/commerce/DocumentDelivery/DDEController?Action=showdoc&DocId=Customer+Drawing%7F1437566-3%7FC2%7Fpdf%7FEnglish%7FENG_CD_1437566-3_C2_1437566_3_1_c.dwg.pdf%7F1437566-3; Mechanical Life: 20000Cycles; Package Reference: FSMSM; REACH SVHC: Unknown; Orientation: Straight; Min Operating Temperature: -35degC; Lead Free: LeadFree; Termination: GullWing; Package Quantity: 1000; Mount: SurfaceMount
SW2 = CMP-1466-00001-1: WS-SLTV 10mm*2.5mm, SPDT, ON-ON, 2.54mm, straight type, THT, Mini Slide Switch, 3 pins; Manufacturer: Wuerth Elektronik; NoPins: 06; ComponentLink2URL: http://katalog.we-online.de/em/datasheet/450301014042.pdf; PartNumber: 450301014042; ComponentLink1Description: Manufacturer URL; ComponentLink2Description: Datasheet; PackageReference: 450301014042; ComponentLink1URL: http://www.we-online.com
U3 = IS31AP2111_Trotta: 2x20W STEREO/1x40W MONO DIGITAL (I2S) AUDIO AMPLIFIER WITH 20 BANDS EQ FUNCTIONS

## Sheet OutputStage.SchDoc: Output stage
size A4; Revision: 1.0; SheetNumber: 4; SheetTotal: 5; Alumno: Trotta, Ignacio; Curso: R1001; Materia: Sistemas de Representación; Docentes: JM Perdomo, E Ipar
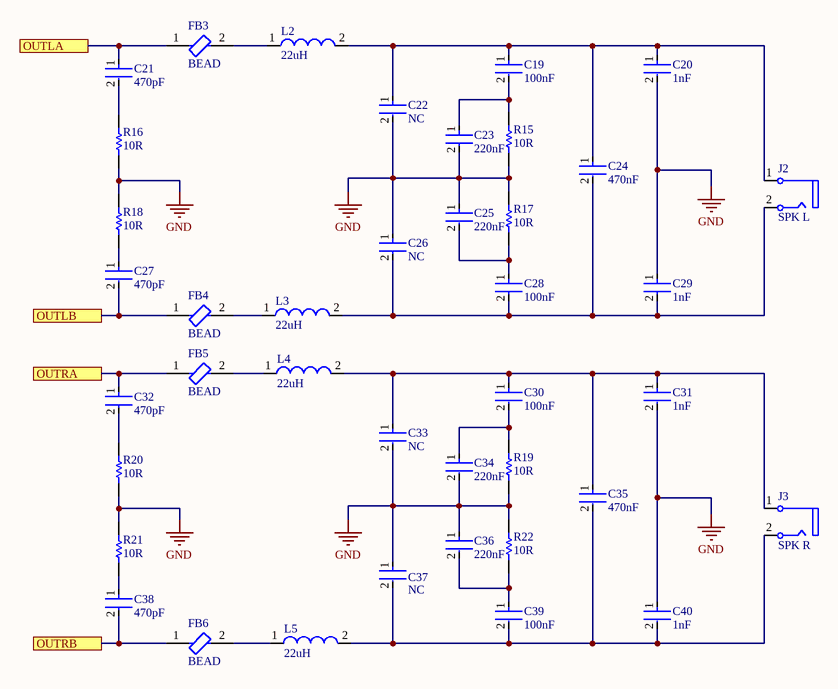
[diagram p4: OutputStage.SchDoc]

### Parts
C19  100nF  [FP-CC0805-0_85-MFG]
C20  1nF  [FP-CC0603-DA-MFG]
C21  470pF  [FP-CC0603-DA-MFG]
C22  NC  [FP-CL31-IPC_C]
C23  220nF  [FP-CC0805-0_85-MFG]
C24  470nF  [FP-CC0603-DA-MFG]
C25  220nF  [FP-CC0805-0_85-MFG]
C26  NC  [FP-CL31-IPC_C]
C27  470pF  [FP-CC0603-DA-MFG]
C28  100nF  [FP-CC0805-0_85-MFG]
C29  1nF  [FP-CC0603-DA-MFG]
C30  100nF  [FP-CC0805-0_85-MFG]
C31  1nF  [FP-CC0603-DA-MFG]
C32  470pF  [FP-CC0603-DA-MFG]
C33  NC  [FP-CL31-IPC_C]
C34  220nF  [FP-CC0805-0_85-MFG]
C35  470nF  [FP-CC0603-DA-MFG]
C36  220nF  [FP-CC0805-0_85-MFG]
C37  NC  [FP-CL31-IPC_C]
C38  470pF  [FP-CC0603-DA-MFG]
C39  100nF  [FP-CC0805-0_85-MFG]
C40  1nF  [FP-CC0603-DA-MFG]
FB3  BEAD  [FP-BLM18-0_15-t0_8-IPC_B]
FB4  BEAD  [FP-BLM18-0_15-t0_8-IPC_B]
FB5  BEAD  [FP-BLM18-0_15-t0_8-IPC_B]
FB6  BEAD  [FP-BLM18-0_15-t0_8-IPC_B]
J2  SPK L  [CUI-RCJ-041_V]
J3  SPK R  [CUI-RCJ-041_V]
L2  22uH  [WE-PD-XXL]
L3  22uH  [WE-PD-XXL]
L4  22uH  [WE-PD-XXL]
L5  22uH  [WE-PD-XXL]
R15  10R  [RESC3116X65X40NL10T20]
R16  10R  [RESC1608X55X25ML10T15]
R17  10R  [RESC3116X65X40NL10T20]
R18  10R  [RESC1608X55X25ML10T15]
R19  10R  [RESC3116X65X40NL10T20]
R20  10R  [RESC1608X55X25ML10T15]
R21  10R  [RESC1608X55X25ML10T15]
R22  10R  [RESC3116X65X40NL10T20]

### Ports
OUTLA, OUTLB, OUTRA, OUTRB

### Nets
GND: C20.2 C22.2 C23.2 C25.1 C26.1 C29.1 C31.2 C33.2 C34.2 C36.1 C37.1 C40.1 R15.1 R16.1 R17.2 R18.2 R19.1 R20.1 R21.2 R22.2
NetC19_1: C19.1 C20.1 C22.1 C24.1 J2.1 L2.2
NetC19_2: C19.2 C23.1 R15.2
NetC21_1: C21.1 FB3.1 ; port OUTLA
NetC21_2: C21.2 R16.2
NetC24_2: C24.2 C26.2 C28.2 C29.2 J2.2 L3.2
NetC25_2: C25.2 C28.1 R17.1
NetC27_1: C27.1 R18.1
NetC27_2: C27.2 FB4.1 ; port OUTLB
NetC30_1: C30.1 C31.1 C33.1 C35.1 J3.1 L4.2
NetC30_2: C30.2 C34.1 R19.2
NetC32_1: C32.1 FB5.1 ; port OUTRA
NetC32_2: C32.2 R20.2
NetC35_2: C35.2 C37.2 C39.2 C40.2 J3.2 L5.2
NetC36_2: C36.2 C39.1 R22.1
NetC38_1: C38.1 R21.1
NetC38_2: C38.2 FB6.1 ; port OUTRB
NetFB3_2: FB3.2 L2.1
NetFB4_2: FB4.2 L3.1
NetFB5_2: FB5.2 L4.1
NetFB6_2: FB6.2 L5.1

### Notes on the sheet
- Title:
- Revision:
- Alumno:
- Materia:
- Docentes:
- Curso:
- File:
- Date:
- Sheet
- of

### Library data of the parts
C19 C28 C30 C39 = CMP-03422-000996-1: CAP CER 0.22UF 50V X7R 0805; Manufacturer: Yageo; Manufacturer Part Number: CC0805KKX7R9BB224; Description: CC0805 220 nF X7R 10.00% 50 V; Tolerance: 0.1; Capacitance: 220 nF; Value: 220 nF; Material: Ceramic; ComponentLink2Description: Datasheet; Temperature Range Low: -30°C; Package: CC0805-0.85; Ipc Land Pattern Name: CAPC200125X85; Lead Free: Yes; Temperature Range High: +85°C; Category: Cap; Temperature: -30°C to +85°C; RoHS: TRUE; Device Class L3: Ceramic Capacitors; ComponentLink2URL: http://www.yageo.com/documents/recent/UPY-GPHC_Y5V_6.3V-to-50V_8.pdf; Voltage Rating: 50 V; Octopart: https://octopart.com/cc0805kkx7r9bb224-yageo-20779595; Digikey Description: CAP CER 0.22UF 50V X7R 0805; Device Class L1: Passive Components; Temperature Characteristic: X7R; Footprint Url: http://www.yageo.com/exep/pages/download/literatures/UPY-C_GEN_24.pdf; Height: 0.95mm; Device Class L2: Capacitors; Automotive: No; Mouser Description: Multilayer Ceramic Capacitors MLCC - SMD/SMT 220nF 50V X7R 10%
C20 C21 C24 C27 C29 C31 C32 C35 C38 C40 = CMP-2100-03600-2: as C10 on sheet IS31AP2111; Mouser Description: Multilayer Ceramic Capacitor, CC Series, 0.01 - F, - 10%, X7R, 50 V, 0603 [1608 Metric]; Digikey Description: CAP CER 10000PF 50V X7R 0603; Height: 0.9mm; Category: Cap; Temperature Characteristic: X7R; Footprint Url: http://www.yageo.com/exep/pages/download/literatures/UPY-C_GEN_24.pdf; Lead Free: Yes; Voltage Rating: 50 V; Temperature: -55°C to +125°C; Device Class L3: Ceramic Capacitors; ComponentLink2Description: Datasheet; Voltage: 50 V; Package: CC0603-DA; Octopart: https://octopart.com/cc0603krx7r9bb103-yageo-192938; Automotive: No; Temperature Range High: +125°C; Temperature Range Low: -55°C; RoHS: TRUE; Device Class L1: Passive Components; ComponentLink2URL: http://www.yageo.com/documents/recent/UPY-GPHC_X7R_6.3V-to-50V_18.pdf; Device Class L2: Capacitors; Capacitance: 10 nF
C22 C26 C33 C37 = CMP-13271-000934-1: Cap Ceramic 1nF 2kV X7R ±20% SMD 1206 +125°C Embossed T/R; Width: 0.063inch; Voltage Rating (DC): 2kV; Voltage Rating: 2kV; Package Quantity: 1; Max Operating Temperature: 125°C; Mount: Surface Mount; Packaging: Tape and Reel; Length: 0.126inch; Capacitance: 1nF; Case Code (Imperial): 1206; Min Operating Temperature: -55°C; Case/Package: 1206; Case Code (Metric): 3216; Tolerance: 20%; Thickness: 0.071inch
C23 C25 C34 C36 = CMP-03422-000996-1: CAP CER 0.22UF 50V X7R 0805; Manufacturer: Yageo; Manufacturer Part Number: CC0805KKX7R9BB224; Description: CC0805 220 nF X7R 10.00% 50 V; Tolerance: 0.1; Material: Ceramic; ComponentLink2Description: Datasheet; Temperature Range Low: -30°C; Package: CC0805-0.85; Ipc Land Pattern Name: CAPC200125X85; Lead Free: Yes; Temperature Range High: +85°C; Category: Cap; Temperature: -30°C to +85°C; RoHS: TRUE; Device Class L3: Ceramic Capacitors; ComponentLink2URL: http://www.yageo.com/documents/recent/UPY-GPHC_Y5V_6.3V-to-50V_8.pdf; Voltage Rating: 50 V; Octopart: https://octopart.com/cc0805kkx7r9bb224-yageo-20779595; Capacitance: 220 nF; Value: 220 nF; Digikey Description: CAP CER 0.22UF 50V X7R 0805; Device Class L1: Passive Components; Temperature Characteristic: X7R; Footprint Url: http://www.yageo.com/exep/pages/download/literatures/UPY-C_GEN_24.pdf; Height: 0.95mm; Device Class L2: Capacitors; Automotive: No; Mouser Description: Multilayer Ceramic Capacitors MLCC - SMD/SMT 220nF 50V X7R 10%
FB3-FB6 = CMP-0686-00503-3: as FB7 on sheet AudioStage; Max Current Rating: 500mA; Case/Package: 0603; Case Code (Imperial): 0603; DC Current: 500mA; Test Frequency: 100MHz; Military Standard: Not; Series: BLM18B; Min Operating Temperature: -55°C; Number of Pins: 2; Termination: SMD/SMT; Length: 1.6mm; Packaging: Tape and Reel; Max Operating Temperature: 125°C; Package Quantity: 1; REACH SVHC: No SVHC; Height: 0.8mm; Radiation Hardening: No; Depth: 0.8mm; Tolerance: 25%; Current Rating: 500mA; Width: 0.8mm; Core Material: Ferrite; RoHS Compliant: Yes; DC Resistance-Max: 300mR; Lead Free: Lead Free; Case Code (Metric): 1608; Number of Circuits: 1
J2 J3 = CMP-1692-00002-1: Female RCJ Jack, 2 Position, Height 11.724 mm, Tail Length 4 mm, RoHS, Bulk; Case\Package: Metal; Connector Type: HDMI; Current Rating: 500 mA; Voltage Rating: 40 V; Length: 16.2 mm; Pins: 19; ComponentLink1URL: http://www.cui.com/; ComponentLink1Description: Manufacturer URL; Packaging: Tape and Reel; Lead Pitch: 0.5 mm; PackageDescription: Female RCJ Jack, 2 Position, Height 11.724 mm, Tail Length 4 mm; RoHSCompliant: true; Min Operating Temperature: -55 degC; Height: 6.1 mm; Contact Material: Copper; REACH SVHC: No SVHC; DatasheetVersion: Rev. B, 02/2012; ComponentLink2Description: Datasheet; Contact Plating: Gold; Colour: Black; Max Operating Temperature: 85 degC; Mount: Surface Mount; Package Quantity: 400; Gender: Female; ComponentLink2URL: http://www.cui.com/product/resource/rcj-04x.pdf; PackageReference: RCJ-041
L2-L5 = CMP-0227-00178-1: SMD-Shielded Power Inductor WE-PD, L = 22.0 µH; Inductance: 22.0 ÂµH; DatasheetVersion: ver 1, Oct-2004; ComponentLink2URL: http://www.we-online.de/katalog/media/pdf/7447709220.pdf; PackageDescription: SMD Inductor, 2-Leads, Body 12.0 x 12.0 mm; PackageVersion: 2004; ComponentLink2Description: Datasheet; PackageReference: WE-PD-XXL; ComponentLink1URL: http://www.we-online.com; ComponentLink1Description: Manufacturer Link
R15 R17 R19 R22 = CMP-2003-03943-1: Part Number: RC1206JR-07100ML; Manufacturer: Yageo
R16 R18 R20 R21 = CMP-2000-05021-1: as R2 on sheet PowerSupply; Manufacturer URL: http://www.yageo.com/; Product: ThickFilmResistorsGeneralPurpose; Package Description: 2-Pin Surface Mount Device, Body 1.6 x 0.8 mm; Tolerance: 5%; Termination Style: SMD/SMT; Datasheet URL: http://www.farnell.com/datasheets/443971.pdf; Operating Temperature Range: -55Cto+155C; Packaging: Reel; Case Code - in: 0603; Package Reference: 603; Series: RC; Case Code - mm: 1608; Datasheet Version: Rev. 4, 04/2009

## Nets that join several sheets
3.3V: PowerSupply (8 pins), AudioStage (6 pins), IS31AP2111 (C17.1 R11.1 R13.2 R14.1)
GND: PowerSupply (20 pins), AudioStage (22 pins), IS31AP2111 (22 pins), OutputStage (20 pins)
VCC: PowerSupply (C8.1 J1.1 R3.1), IS31AP2111 (FB1.2 FB2.2)
NetC21_1: IS31AP2111 (U3.22), OutputStage (C21.1 FB3.1)
NetC27_2: IS31AP2111 (U3.20), OutputStage (C27.2 FB4.1)
NetC32_1: IS31AP2111 (U3.15), OutputStage (C32.1 FB5.1)
NetC38_2: IS31AP2111 (U3.17), OutputStage (C38.2 FB6.1)
NetC41_1: AudioStage (C41.1 C42.1 FB7.2), IS31AP2111 (U3.9)
NetP1_1: PowerSupply (P1.1 R6.1), IS31AP2111 (U3.6)
NetP1_2: PowerSupply (P1.2 R5.1), IS31AP2111 (U3.5)
NetP3_1: PowerSupply (X1.3), AudioStage (U4.2), IS31AP2111 (P3.1)
NetP7_2: AudioStage (P7.2), IS31AP2111 (U3.10)
NetR8_1: AudioStage (U4.4), IS31AP2111 (R8.1)
NetR9_1: AudioStage (U4.8), IS31AP2111 (R9.1)
NetR10_1: AudioStage (U4.7), IS31AP2111 (R10.1)